# Altium project ESP32.PrjPcb
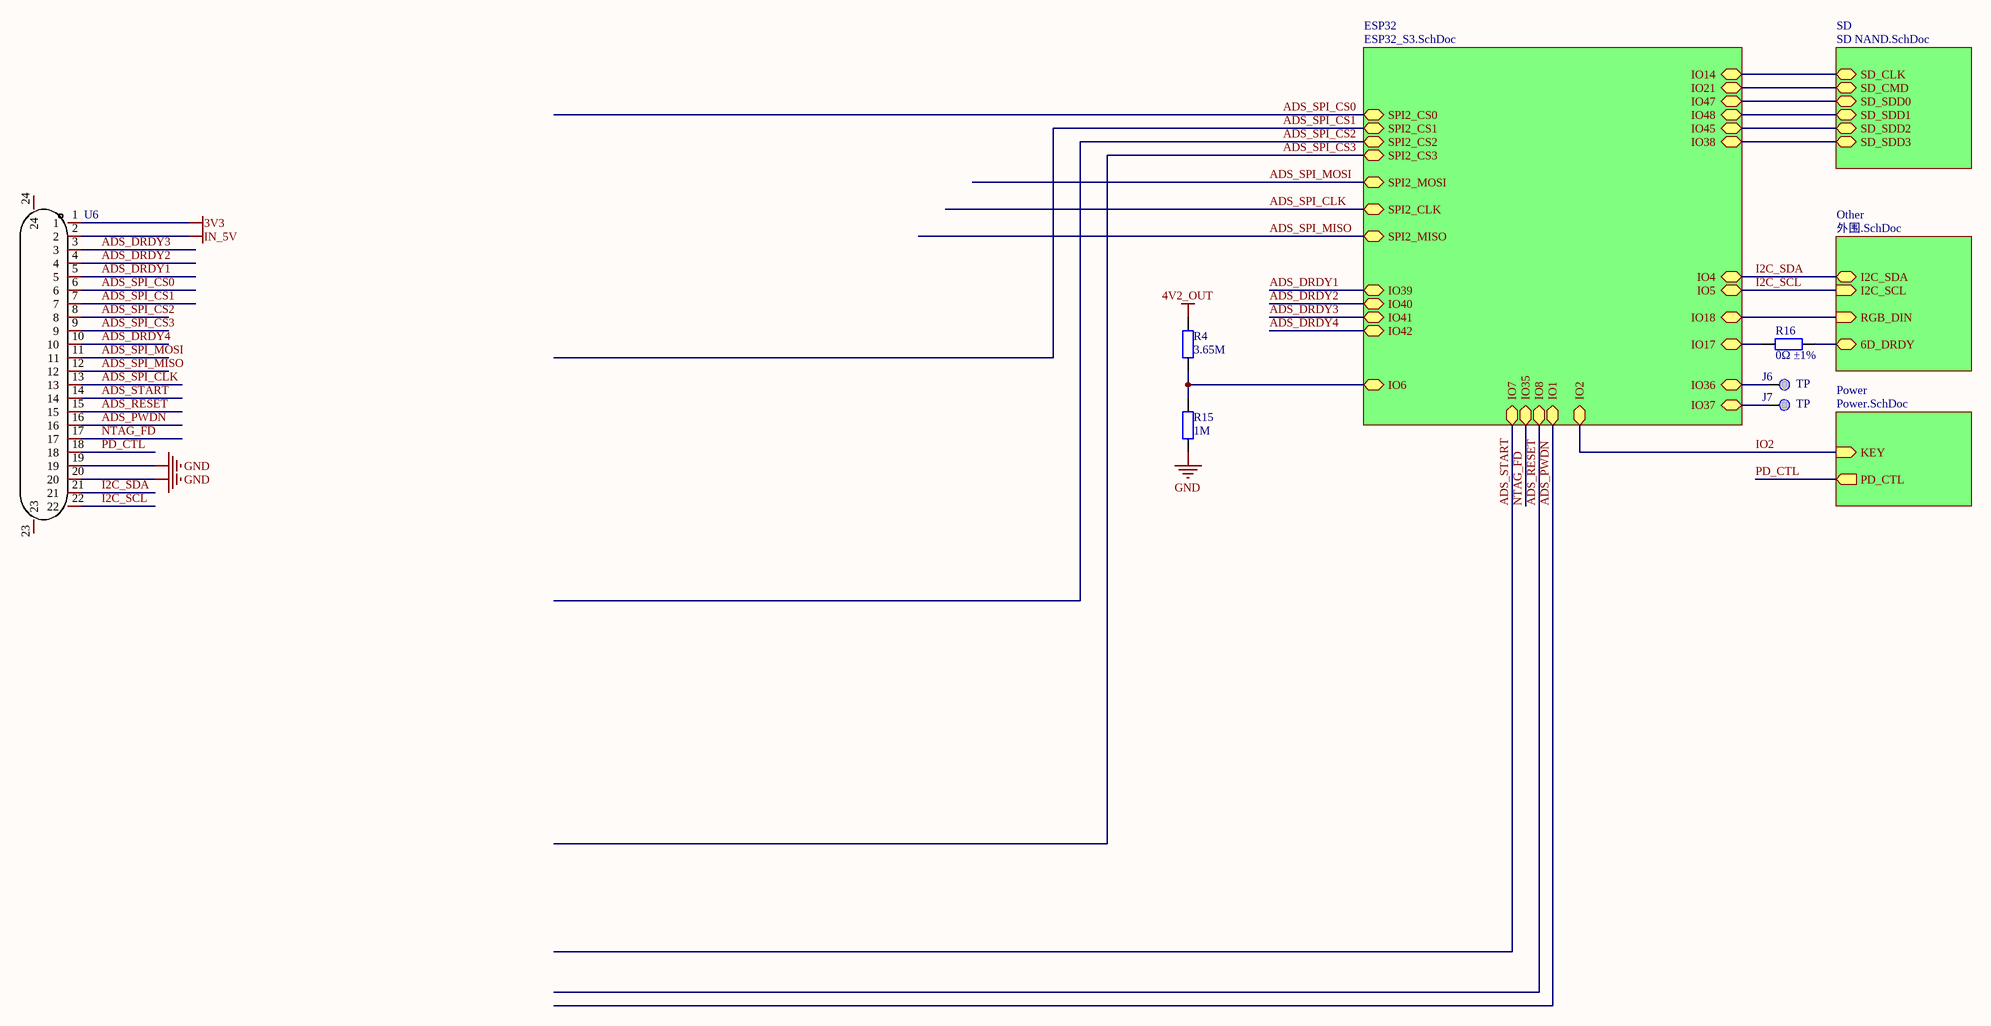
[diagram p0: Main.SchDoc]
5 sheets, 69 parts. Net scope: hierarchical (ports join the sheet entries above them; power ports are global).
Board file: ESP32.PcbDoc
Sheets:
  Main.SchDoc
    ESP32 = ESP32_S3.SchDoc
    SD = SD NAND.SchDoc
    Other = 外围.SchDoc
    Power = Power.SchDoc

## Sheet Main.SchDoc
size A2; SheetNumber: 1; SheetTotal: 5

### Parts
J6  TP  [TEST_Point]
J7  TP  [TEST_Point]
R4  3.65M  [0603_R]
R15  1M  [0603_R]
R16  0Ω ±1%  [0402_R]
U6  KH-FPC0.5-H1.0SMT-22P-QCHF  [FPC-SMD_22P-P0.50_XKB_X05A10L22G]  (value not drawn)

### Sub-sheets
ESP32 = ESP32_S3.SchDoc: SPI2_CLK (bidir), SPI2_MISO (bidir), SPI2_MOSI (bidir), SPI2_CS0 (bidir), SPI2_CS1 (bidir), SPI2_CS2 (bidir), SPI2_CS3 (bidir), IO4 (bidir), IO5 (bidir), IO6 (bidir), IO7 (bidir), IO17 (bidir), IO8 (bidir), IO1 (bidir), IO2 (bidir), IO14 (bidir), IO21 (bidir), IO47 (bidir), IO48 (bidir), IO45 (bidir), IO38 (bidir), IO39 (bidir), IO40 (bidir), IO41 (bidir), IO42 (bidir), IO18 (bidir), IO35 (bidir), IO36 (bidir), IO37 (bidir)
Other = 外围.SchDoc: I2C_SCL (in), I2C_SDA (bidir), RGB_DIN (in), 6D_DRDY (bidir)
Power = Power.SchDoc: KEY (in), PD_CTL (out)
SD = SD NAND.SchDoc: SD_CLK (bidir), SD_CMD (bidir), SD_SDD0 (bidir), SD_SDD1 (bidir), SD_SDD2 (bidir), SD_SDD3 (bidir)

### Nets
3V3: U6.1
4V2_OUT: R4.1
GND: R15.2 U6.19 U6.20
IN_5V: U6.2
6D_DRDY: R16.2 ; sheet Other/6D_DRDY
ADS_DRDY1: U6.5 ; sheet ESP32/IO39
ADS_DRDY2: U6.4 ; sheet ESP32/IO40
ADS_DRDY3: U6.3 ; sheet ESP32/IO41
ADS_DRDY4: U6.10 ; sheet ESP32/IO42
ADS_PWDN: U6.16 ; sheet ESP32/IO1
ADS_RESET: U6.15 ; sheet ESP32/IO8
ADS_SPI_CLK: U6.13 ; sheet ESP32/SPI2_CLK
ADS_SPI_CS0: U6.6 ; sheet ESP32/SPI2_CS0
ADS_SPI_CS1: U6.7 ; sheet ESP32/SPI2_CS1
ADS_SPI_CS2: U6.8 ; sheet ESP32/SPI2_CS2
ADS_SPI_CS3: U6.9 ; sheet ESP32/SPI2_CS3
ADS_SPI_MISO: U6.12 ; sheet ESP32/SPI2_MISO
ADS_SPI_MOSI: U6.11 ; sheet ESP32/SPI2_MOSI
ADS_START: U6.14 ; sheet ESP32/IO7
I2C_SCL: U6.22 ; sheet ESP32/IO5, sheet Other/I2C_SCL
I2C_SDA: U6.21 ; sheet ESP32/IO4, sheet Other/I2C_SDA
IO2: sheet ESP32/IO2, sheet Power/KEY
IO6: R4.2 R15.1 ; sheet ESP32/IO6
IO14: sheet ESP32/IO14, sheet SD/SD_CLK
IO17: R16.1 ; sheet ESP32/IO17
IO18: sheet ESP32/IO18, sheet Other/RGB_DIN
IO21: sheet ESP32/IO21, sheet SD/SD_CMD
IO36: J6.1 ; sheet ESP32/IO36
IO37: J7.1 ; sheet ESP32/IO37
IO38: sheet ESP32/IO38, sheet SD/SD_SDD3
IO45: sheet ESP32/IO45, sheet SD/SD_SDD2
IO47: sheet ESP32/IO47, sheet SD/SD_SDD0
IO48: sheet ESP32/IO48, sheet SD/SD_SDD1
NTAG_FD: U6.17 ; sheet ESP32/IO35  [project net IO35]
PD_CTL: U6.18 ; sheet Power/PD_CTL

Not connected (* = marked no-connect by the designer): U6 23 24

### Library data of the parts
J6 J7 = TestPad: Add into BOM: yes
R4 R15 R16 = Res2: Resistor; Add into BOM: yes; PackageReference: AXIAL-0.4; PackageDescription: Axial Device, Thru-Hole; 2 Leads; 0.4 in Pin Spacing
  R4: Value: 3.65M
  R15: Value: 1M
  R16: Value: 0Ω ±1%
U6 = KH-FPC0.5-H1.0SMT-22P-QCHF: 锁定特性:翻盖式;触点数量:22P;间距:0.5mm;; Manufacturer: kinghelm(金航标); Add into BOM: yes; Locking Feature: 翻盖式; Number of Contacts: 22P; Pitch: 0.5mm; Name: KH-FPC0.5-H1.0SMT-22P-QCHF; Symbol: KH-FPC0.5-H1.0SMT-22P-QCHF; Device: KH-FPC0.5-H1.0SMT-22P-QCHF; LCSC Part Name: KH-FPC0.5-H1.0SMT-22P-QCHF; Supplier Part: C3250120; Manufacturer Part: KH-FPC0.5-H1.0SMT-22P-QCHF; Supplier Footprint: SMD,P=0.5mm; JLCPCB Part Class: 扩展库; Datasheet: https://atta.szlcsc.com/upload/public/pdf/source/20220629/AF128159C3D91429B5983CCCE2A07C6D.pdf; Supplier: LCSC; Convert to PCB: yes; Height Above Board: 1mm

## Sheet ESP32_S3.SchDoc
size A3; SheetNumber: 5; SheetTotal: 5
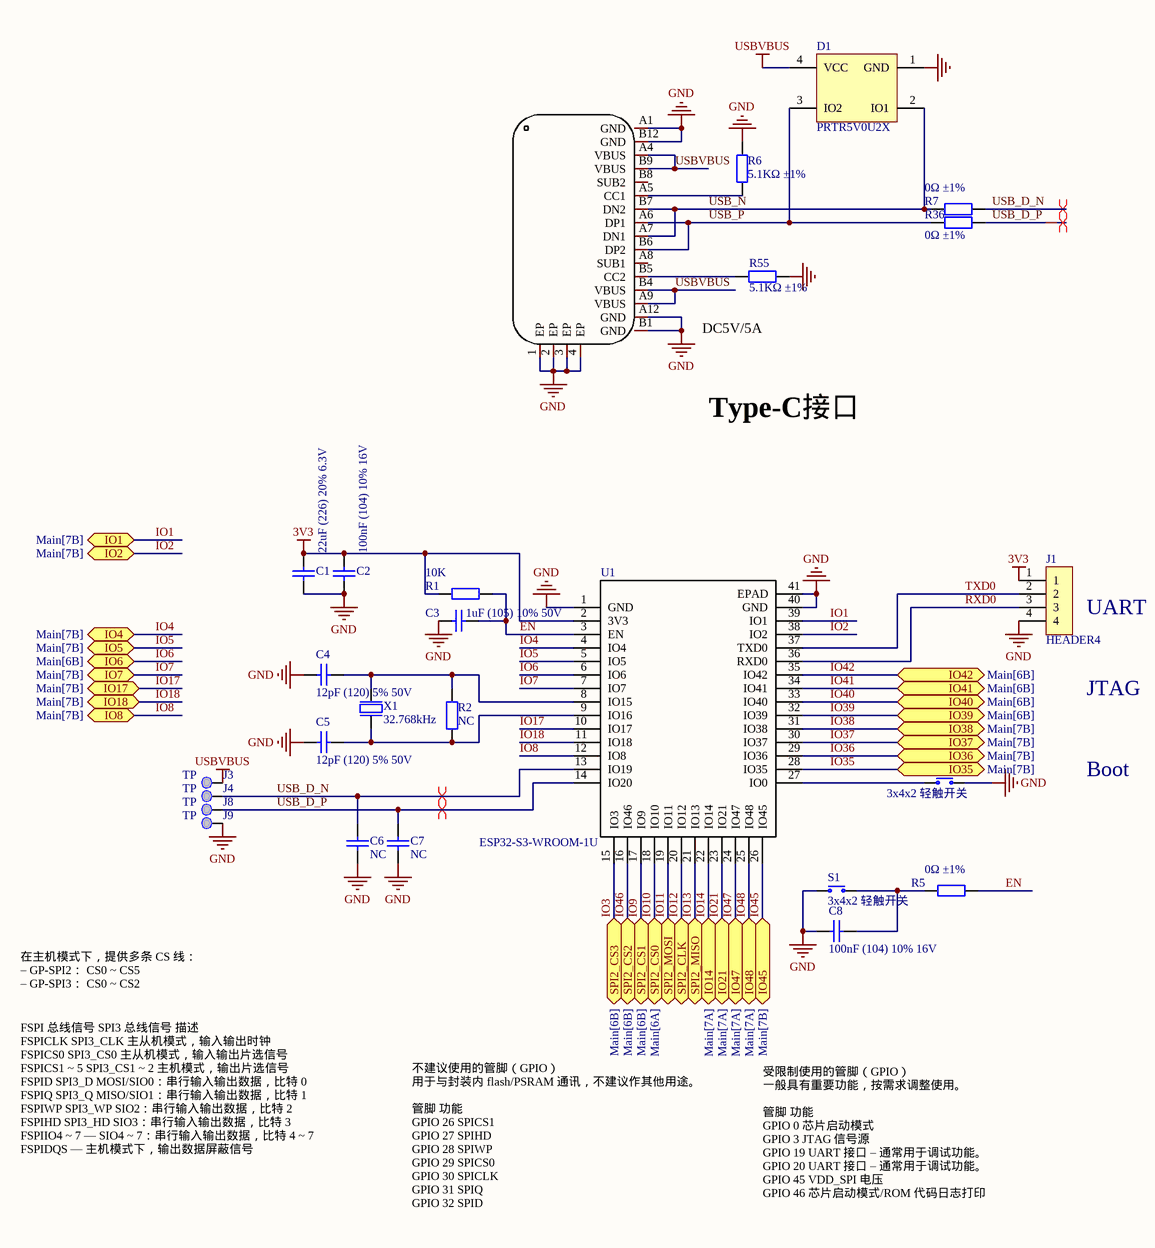
[diagram p1: ESP32_S3.SchDoc]

### Parts
C1  22uF (226) 20% 6.3V  [0402_C]
C2  100nF (104) 10% 16V  [0201_C]
C3  1uF (105) 10% 50V  [0201_C]
C4  12pF (120) 5% 50V  [0201_C]
C5  12pF (120) 5% 50V  [0201_C]
C6  NC  [0402_C]
C7  NC  [0402_C]
C8  100nF (104) 10% 16V  [0201_C]
D1  PRTR5V0U2X  [SOT190P230X110-4L]
J1  HEADER4  [HEADER4_2.54MM_排针]
J3  TP  [TEST_Point]
J4  TP  [TEST_Point]
J8  TP  [TEST_Point]
J9  TP  [TEST_Point]
R1  10K  [0201_R]
R2  NC  [0402_R]
R5  0Ω ±1%  [0402_R]
R6  5.1KΩ ±1%  [0402_R]
R7  0Ω ±1%  [0402_R]
R36  0Ω ±1%  [0402_R]
R55  5.1KΩ ±1%  [0402_R]
S1  3x4x2 轻触开关  [KEY_3x4X2包脚U型]
S3  3x4x2 轻触开关  [KEY_3x4X2包脚U型]
U1  ESP32-S3-WROOM-1U  [WIRELM-SMD_ESP32-S3-WROOM-1U]
USB1  KH-TYPE-C-16P  [USB-C-SMD_KH-TYPE-C-16P]  (value not drawn)
X1  32.768kHz  [XTAL_3215]

### Ports
IO1 (bidir, see Main[7B]), IO2 (bidir, see Main[7B]), IO4 (bidir, see Main[7B]), IO5 (bidir, see Main[7B]), IO6 (bidir, see Main[6B]), IO7 (bidir, see Main[7B]), IO8 (bidir, see Main[7B]), IO14 (bidir, see Main[7A]), IO17 (bidir, see Main[7B]), IO18 (bidir, see Main[7B]), IO21 (bidir, see Main[7A]), IO35 (bidir, see Main[7B]), IO36 (bidir, see Main[7B]), IO37 (bidir, see Main[7B]), IO38 (bidir, see Main[7B]), IO39 (bidir, see Main[6B]), IO40 (bidir, see Main[6B]), IO41 (bidir, see Main[6B]), IO42 (bidir, see Main[6B]), IO45 (bidir, see Main[7B]), IO47 (bidir, see Main[7A]), IO48 (bidir, see Main[7A]), SPI2_CLK (bidir, see Main[6B]), SPI2_CS0 (bidir, see Main[6A]), SPI2_CS1 (bidir, see Main[6B]), SPI2_CS2 (bidir, see Main[6B]), SPI2_CS3 (bidir, see Main[6B]), SPI2_MISO (bidir, see Main[6B]), SPI2_MOSI (bidir, see Main[6B])

### Nets
3V3: C1.2 C2.2 J1.1 R1.2 U1.2(3V3)
GND: C1.1 C2.1 C3.1 C4.1 C5.1 C6.1 C7.1 C8.2 D1.1(GND) J1.4 J9.1 R6.1 R55.2 S1.2 S3.1 U1.1(GND) U1.40(GND) U1.41(EPAD) USB1.1(EP) USB1.2(EP) USB1.3(EP) USB1.4(EP) USB1.A1(GND) USB1.A12(GND) USB1.B1(GND) USB1.B12(GND)
USBVBUS: D1.4(VCC) J3.1 USB1.A4(VBUS) USB1.A9(VBUS) USB1.B4(VBUS) USB1.B9(VBUS)
EN: C3.2 R1.1 R5.2 U1.3(EN)
IO1: U1.39(IO1) ; port IO1  [project net ADS_PWDN]
IO2: U1.38(IO2) ; port IO2
IO3: U1.15(IO3) ; port SPI2_CS3  [project net ADS_SPI_CS3]
IO4: U1.4(IO4) ; port IO4  [project net I2C_SDA]
IO5: U1.5(IO5) ; port IO5  [project net I2C_SCL]
IO6: U1.6(IO6) ; port IO6
IO7: U1.7(IO7) ; port IO7  [project net ADS_START]
IO8: U1.12(IO8) ; port IO8  [project net ADS_RESET]
IO9: U1.17(IO9) ; port SPI2_CS1  [project net ADS_SPI_CS1]
IO10: U1.18(IO10) ; port SPI2_CS0  [project net ADS_SPI_CS0]
IO11: U1.19(IO11) ; port SPI2_MOSI  [project net ADS_SPI_MOSI]
IO12: U1.20(IO12) ; port SPI2_CLK  [project net ADS_SPI_CLK]
IO13: U1.21(IO13) ; port SPI2_MISO  [project net ADS_SPI_MISO]
IO14: U1.22(IO14) ; port IO14
IO17: U1.10(IO17) ; port IO17
IO18: U1.11(IO18) ; port IO18
IO21: U1.23(IO21) ; port IO21
IO35: U1.28(IO35) ; port IO35
IO36: U1.29(IO36) ; port IO36
IO37: U1.30(IO37) ; port IO37
IO38: U1.31(IO38) ; port IO38
IO39: U1.32(IO39) ; port IO39  [project net ADS_DRDY1]
IO40: U1.33(IO40) ; port IO40  [project net ADS_DRDY2]
IO41: U1.34(IO41) ; port IO41  [project net ADS_DRDY3]
IO42: U1.35(IO42) ; port IO42  [project net ADS_DRDY4]
IO45: U1.26(IO45) ; port IO45
IO46: U1.16(IO46) ; port SPI2_CS2  [project net ADS_SPI_CS2]
IO47: U1.24(IO47) ; port IO47
IO48: U1.25(IO48) ; port IO48
RXD0: J1.3 U1.36(RXD0)
TXD0: J1.2 U1.37(TXD0)
USB_D_N: C6.2 J4.1 R7.2 U1.13(IO19)
USB_D_P: C7.2 J8.1 R36.2 U1.14(IO20)
USB_N: D1.2(IO1) R7.1 USB1.A7(DN1) USB1.B7(DN2)
USB_P: D1.3(IO2) R36.1 USB1.A6(DP1) USB1.B6(DP2)
NetC4_2: C4.2 R2.2 U1.8(IO15) X1.1(inp)
NetC5_2: C5.2 R2.1 U1.9(IO16) X1.2(out)
NetC8_1: C8.1 R5.1 S1.1
NetR6_2: R6.2 USB1.A5(CC1)
NetR55_1: R55.1 USB1.B5(CC2)
NetS3_2: S3.2 U1.27(IO0)

Not connected (* = marked no-connect by the designer): USB1 A8(SUB1) B8(SUB2)

### Layout directives
differential pair; differential pair class USB; net class USB: USB_D_N, USB_D_P

### Notes on the sheet
- DC5V/5A
- Type-C接口
- (near J1) UART
- JTAG
- Boot
- 在主机模式下，提供多条 CS 线：
  – GP­SPI2： CS0 ~ CS5
  – GP­SPI3： CS0 ~ CS2
- FSPI 总线信号 SPI3 总线信号 描述
  FSPICLK SPI3_CLK 主从机模式，输入输出时钟
  FSPICS0 SPI3_CS0 主从机模式，输入输出片选信号
  FSPICS1 ~ 5 SPI3_CS1 ~ 2 主机模式，输出片选信号
  FSPID SPI3_D MOSI/SIO0：串行输入输出数据，比特 0
  FSPIQ SPI3_Q MISO/SIO1：串行输入输出数据，比特 1
  FSPIWP SPI3_WP SIO2：串行输入输出数据，比特 2
  FSPIHD SPI3_HD SIO3：串行输入输出数据，比特 3
  FSPIIO4 ~ 7 — SIO4 ~ 7：串行输入输出数据，比特 4 ~ 7
  FSPIDQS — 主机模式下，输出数据屏蔽信号
- 不建议使用的管脚（GPIO）
  用于与封装内 flash/PSRAM 通讯，不建议作其他用途。
  管脚	功能
  GPIO 26	SPICS1
  GPIO 27	SPIHD
  GPIO 28	SPIWP
  GPIO 29	SPICS0
  GPIO 30	SPICLK
  GPIO 31	SPIQ
  GPIO 32	SPID
- 受限制使用的管脚（GPIO）
  一般具有重要功能，按需求调整使用。
  管脚	功能
  GPIO 0	芯片启动模式
  GPIO 3	JTAG 信号源
  GPIO 19	UART 接口 – 通常用于调试功能。
  GPIO 20	UART 接口 – 通常用于调试功能。
  GPIO 45	VDD_SPI 电压
  GPIO 46	芯片启动模式/ROM 代码日志打印

### Library data of the parts
C1 = 0603 22uF (226) 20% 6.3V: 贴片电容; ComponentLink1Description: 供应商链接; ComponentLink1URL: http://www.szlcsc.com/product/details_60514.html; Package: 0603; Supplier: LC; SuppliersPartNumber: C59461
C2 C8 = 0402 100nF (104) 10% 16V: 贴片电容; ComponentLink1Description: 供应商链接; ComponentLink1URL: http://www.szlcsc.com/product/details_1877.html; Package: 0402; Supplier: LC; SuppliersPartNumber: C1525
C3 = 0603 1uF (105) 10% 50V: 贴片电容; ComponentLink1Description: 供应商链接; ComponentLink1URL: http://www.szlcsc.com/product/details_16531.html; Package: 0603; Supplier: LC; SuppliersPartNumber: C15849
C4-C7 = 0402 12pF (120) 5% 50V: 贴片电容; ComponentLink1Description: 供应商链接; ComponentLink1URL: http://www.szlcsc.com/product/details_1899.html; Package: 0402; Supplier: LC; SuppliersPartNumber: C1547
D1 = PRTR5V0U2X: Ultra low capacitance double rail-to-rail ESD protection diode; Manufacturer: NXP; 2nd source part number: 152-4157; Artikkelnr Noca: 10069015; Artikkelnr Simpro: N.A.; Part Number: PRTR5V0U2X; Manufacturer Part Number: PRTR5V0U2X; Datasheet: http://www.farnell.com/datasheets/109718.pdf; LatestRevisionDate: 2012-06-11; Publisher: Nordic Semiconductor; Published: 2012-06-11; Value: PRTR5V0U2X; Note: *; Supplier: Digi-Key; Supplier part number: 568-4140-1-ND; 2nd source Supplier: Farnell; Footprint Doc: SOT-143B
J3 J4 J8 J9 = TestPad: Add into BOM: yes
R1 R2 = 0402 10KΩ (1002) 1%: 贴片电阻; ComponentLink1Description: 供应商链接; ComponentLink1URL: http://www.szlcsc.com/product/details_26487.html; Package: 0402; Supplier: LC; SuppliersPartNumber: C25744
R5 = 0402 0Ω (0R0) 1%: 贴片电阻; ComponentLink1Description: 供应商链接; ComponentLink1URL: http://www.szlcsc.com/product/details_17853.html; Package: 0402; Supplier: LC; SuppliersPartNumber: C17168
R6 R55 = 0402 5.1KΩ (5101) 1%: 贴片电阻; Add into BOM: yes; Supplier: LC; SuppliersPartNumber: C25905
R7 R36 = 0402 0Ω (0R0) 1%: 贴片电阻; Add into BOM: yes; Supplier: LC; SuppliersPartNumber: C17168
S1 S3 = SW-PB_包脚U型小乌龟: Add into BOM: yes; 供应商链接: https://item.szlcsc.com/6227348.html
USB1 = KH-TYPE-C-16P: Add into BOM: yes; Supplier: LCSC; 供应商链接: https://item.szlcsc.com/747093.html
X1 = XTAL_SMD3215_32.768kHz_9pF_General: XTAL SMD 3215, 32.768kHz, Cl=9pF, Total Tol: ±50ppm; Pad Count: 2; Part Number: XTAL_SMD3215_32.768kHz_9pF_General; LatestRevisionDate: 2016-08-19; Published: 2016-08-19; Value: 32.768kHz; Footprint Doc: XTAL_3215

## Sheet SD NAND.SchDoc
size A4; SheetNumber: 4; SheetTotal: 5
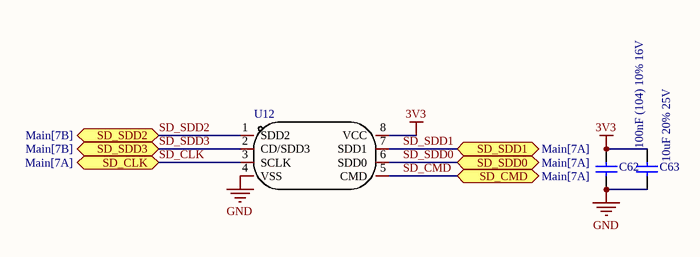
[diagram p2: SD NAND.SchDoc]

### Parts
C62  100nF (104) 10% 16V  [0402_C]
C63  10uF 20% 25V  [0402_C]
U12  CSNP1GCR01-BOW  [LGA-8_L6.0-W8.0-P1.27-TL]  (value not drawn)

### Ports
SD_CLK (bidir, see Main[7A]), SD_CMD (bidir, see Main[7A]), SD_SDD0 (bidir, see Main[7A]), SD_SDD1 (bidir, see Main[7A]), SD_SDD2 (bidir, see Main[7B]), SD_SDD3 (bidir, see Main[7B])

### Nets
3V3: C62.1 C63.2 U12.8(VCC)
GND: C62.2 C63.1 U12.4(VSS)
SD_CLK: U12.3(SCLK) ; port SD_CLK  [project net IO14]
SD_CMD: U12.5(CMD) ; port SD_CMD  [project net IO21]
SD_SDD0: U12.6(SDD0) ; port SD_SDD0  [project net IO47]
SD_SDD1: U12.7(SDD1) ; port SD_SDD1  [project net IO48]
SD_SDD2: U12.1(SDD2) ; port SD_SDD2  [project net IO45]
SD_SDD3: U12.2(CD/SDD3) ; port SD_SDD3  [project net IO38]

### Library data of the parts
C62 = 0402 100nF (104) 10% 16V: 贴片电容; ComponentLink1Description: 供应商链接; ComponentLink1URL: http://www.szlcsc.com/product/details_1877.html; Package: 0402; Supplier: LC; SuppliersPartNumber: C1525
C63 = 0603 10uF (106) 10% 10V: 贴片电容; ComponentLink1Description: 供应商链接; ComponentLink1URL: http://www.szlcsc.com/product/details_20411.html; Package: 0603; Supplier: LC; SuppliersPartNumber: C19702
U12 = CSNP1GCR01-BOW: 免驱动使用，标准SDIO接口，兼容SPI/SD/eMMC接口，兼容各大MCU平台;内置EDC/ECC，坏块管理，垃圾回收算法;可机贴，锁定晶圆和控制器,一致性高；内置SLC晶圆,10W次擦写寿命，通过1万次随机掉电测试，支持工业级温度-40°~+85°。 CS(创世) SD NAND也被很多开发者朋友称为：贴片式TF卡，贴片式SD卡，贴片卡，焊接式SD卡，焊接式TF卡，工业级TF卡，工业级SD卡，嵌入式SD卡等。主要解决了主控(比如STM32系列的MCU单片机 )使用 SLC NAND FLASH,SPI; Manufacturer: CS(创世); Add into BOM: yes; Name: CSNP1GCR01-BOW; Symbol: CSNP1GCR01-BOW; Device: CSNP1GCR01-BOW; LCSC Part Name: 1Gb SD NAND 一代 SD NAND 一代; Supplier Part: C2691593; Manufacturer Part: CSNP1GCR01-BOW; Supplier Footprint: LGA-8(6x8); JLCPCB Part Class: 扩展库; Datasheet: https://atta.szlcsc.com/upload/public/pdf/source/20210222/C2691593_195F15B6690BC3EBF1684FE727FBFF20.pdf; Supplier: LCSC; Convert to PCB: yes

## Sheet 外围.SchDoc
size A4; SheetNumber: 2; SheetTotal: 5
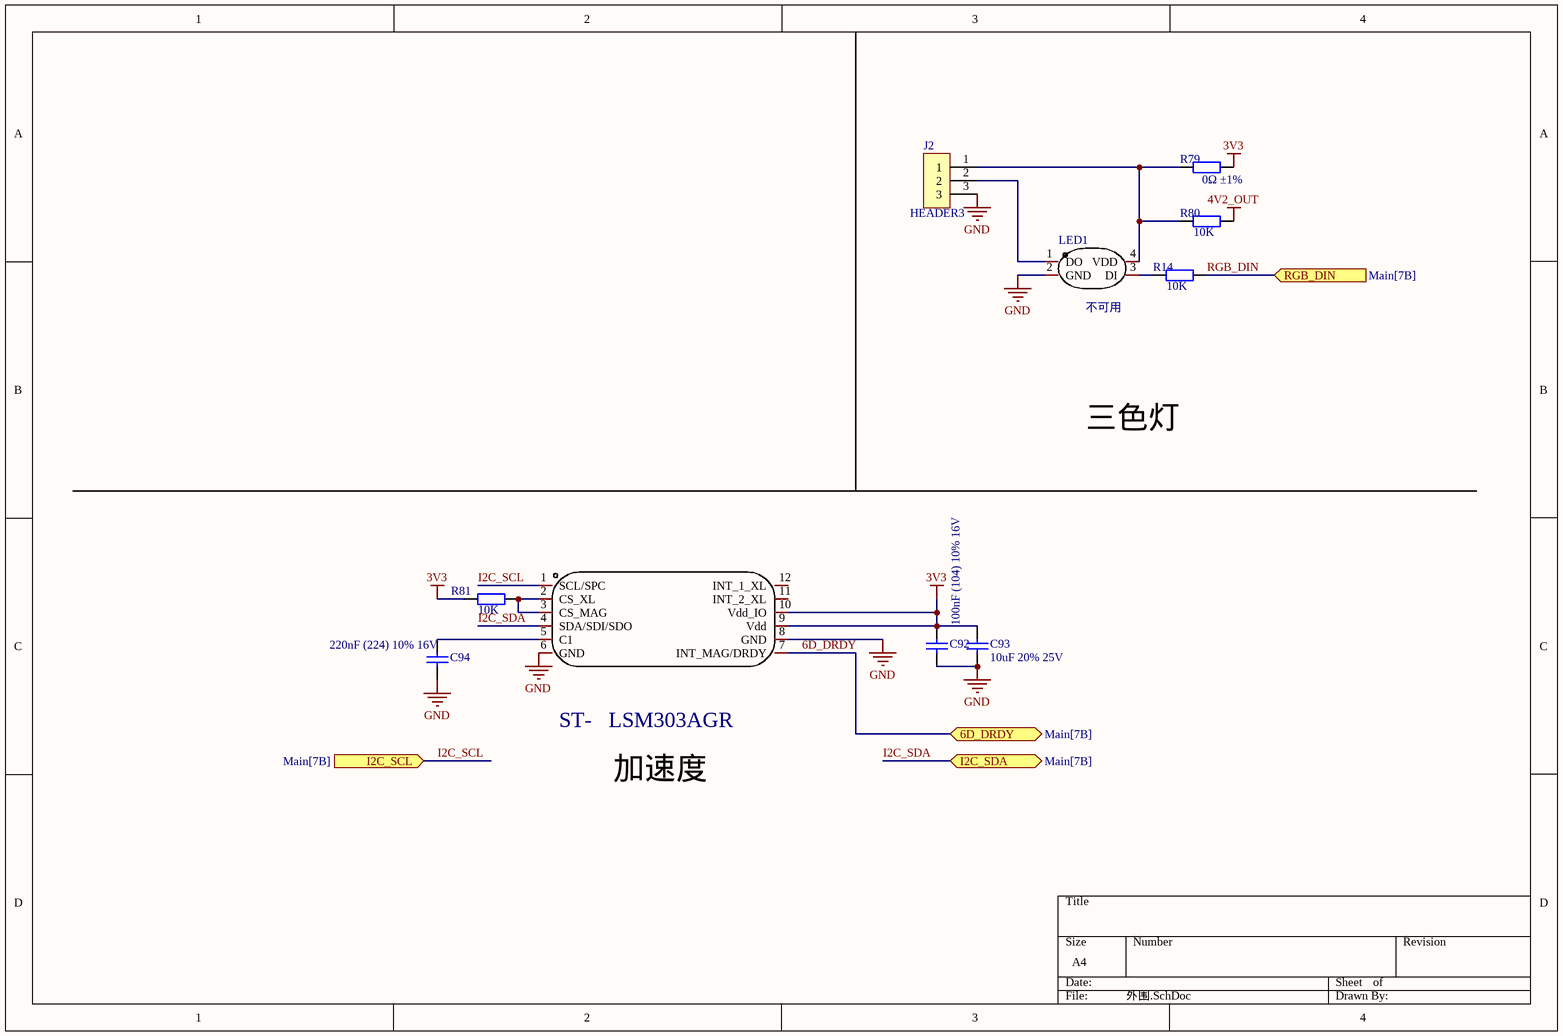
[diagram p3: 外围.SchDoc]

### Parts
C92  100nF (104) 10% 16V  [0402_C]
C93  10uF 20% 25V  [0402_C]
C94  220nF (224) 10% 16V  [0201_C]
J2  HEADER3  [HEADER3]
LED1  WS2812B-2020  [LED-SMD_4P-L2.0-W2.0-TL_WS2812B-2020]  (value not drawn)
R14  10K  [0402_R]
R79  0Ω ±1%  [0402_R]
R80  value 10K  [0402_R]  (hidden comment: NC)
R81  10K  [0201_R]
U15  LSM303AGRTR  [LGA-12_L2.0-W2.0-P0.50-BL]  (value not drawn)

### Ports
6D_DRDY (bidir, see Main[7B]), I2C_SCL (in, see Main[7B]), I2C_SDA (bidir, see Main[7B]), RGB_DIN (in, see Main[7B])

### Nets
3V3: C92.2 C93.2 R79.2 R81.1 U15.9(Vdd) U15.10(Vdd_IO)
4V2_OUT: R80.2
GND: C92.1 C93.1 C94.1 J2.3 LED1.2(GND) U15.6(GND) U15.8(GND)
6D_DRDY: U15.7(INT_MAG/DRDY) ; port 6D_DRDY
I2C_SCL: U15.1(SCL/SPC) ; port I2C_SCL
I2C_SDA: U15.4(SDA/SDI/SDO) ; port I2C_SDA
RGB_DIN: R14.2 ; port RGB_DIN  [project net IO18]
NetC94_2: C94.2 U15.5(C1)
NetJ2_1: J2.1 LED1.4(VDD) R79.1 R80.1
NetJ2_2: J2.2 LED1.1(DO)
NetLED1_3: LED1.3(DI) R14.1
NetR81_2: R81.2 U15.2(CS_XL) U15.3(CS_MAG)

Not connected (* = marked no-connect by the designer): U15 11(INT_2_XL) 12(INT_1_XL)

### Notes on the sheet
- (near LED1) 不可用
- 三色灯
- ST-   LSM303AGR
- 加速度

### Library data of the parts
C92 = 0402 100nF (104) 10% 16V: 贴片电容; ComponentLink1Description: 供应商链接; ComponentLink1URL: http://www.szlcsc.com/product/details_1877.html; Package: 0402; Supplier: LC; SuppliersPartNumber: C1525
C93 = 0402 10uF (106) 20% 6.3V: 贴片电容; ComponentLink1Description: 供应商链接; ComponentLink1URL: http://www.szlcsc.com/product/details_16204.html; Package: 0402; Supplier: LC; SuppliersPartNumber: C15525
C94 = 0402 220nF (224) 10% 16V: 贴片电容; ComponentLink1Description: 供应商链接; ComponentLink1URL: http://www.szlcsc.com/product/details_17456.html; Package: 0402; Supplier: LC; SuppliersPartNumber: C16772
LED1 = WS2812B-2020: 发光颜色:RGB三色;二极管配置:-;功率:-;透镜颜色:-;主波长:470.4nm；622.5nm；515.6nm;色温:-;发光角度:-;安装方式:-;工作温度:-;; Manufacturer: worldsemi; Add into BOM: yes; Emitted Color: RGB三色; Forward Current: 12mA; Name: WS2812B-2020; Symbol: WS2812B-2020; Device: WS2812B-2020; LCSC Part Name: RGB三色 （注意防潮，请查阅规格书中对应具体内容）; Supplier Part: C965555; Manufacturer Part: WS2812B-2020; Supplier Footprint: SMD,2x2mm; JLCPCB Part Class: 扩展库; Datasheet: https://atta.szlcsc.com/upload/public/pdf/source/20201203/C965555_5C919C4B6231E6ADE06011FB0D94282B.pdf; Supplier: LCSC; Convert to PCB: yes; Diode Configuration: -; Power Dissipation: -; Lens Color: -; Dominant Wavelength: 470.4nm；622.5nm；515.6nm; Peak Wavelength: -; Color Temperature: -; Viewing Angle: -; Mounting Sytle: -; Operating Temperature: -
R14 R79-R81 = Res2: Resistor
  R14 R81: Value: 10K
U15 = LSM303AGRTR: Manufacturer: ST(意法半导体); Add into BOM: yes; Name: LSM303AGRTR; Symbol: LSM303AGRTR; Device: LSM303AGRTR; LCSC Part Name: LSM303AGRTR; Supplier Part: C126671; Manufacturer Part: LSM303AGRTR; Supplier Footprint: LGA-12; JLCPCB Part Class: Extended Part; Datasheet: https://atta.szlcsc.com/upload/public/pdf/source/20180403/C126671_E4CABC5ABBEC58D74E548CEDEFA0489C.pdf; Supplier: LCSC; Convert to PCB: yes

## Sheet Power.SchDoc
size A2; SheetNumber: 3; SheetTotal: 5
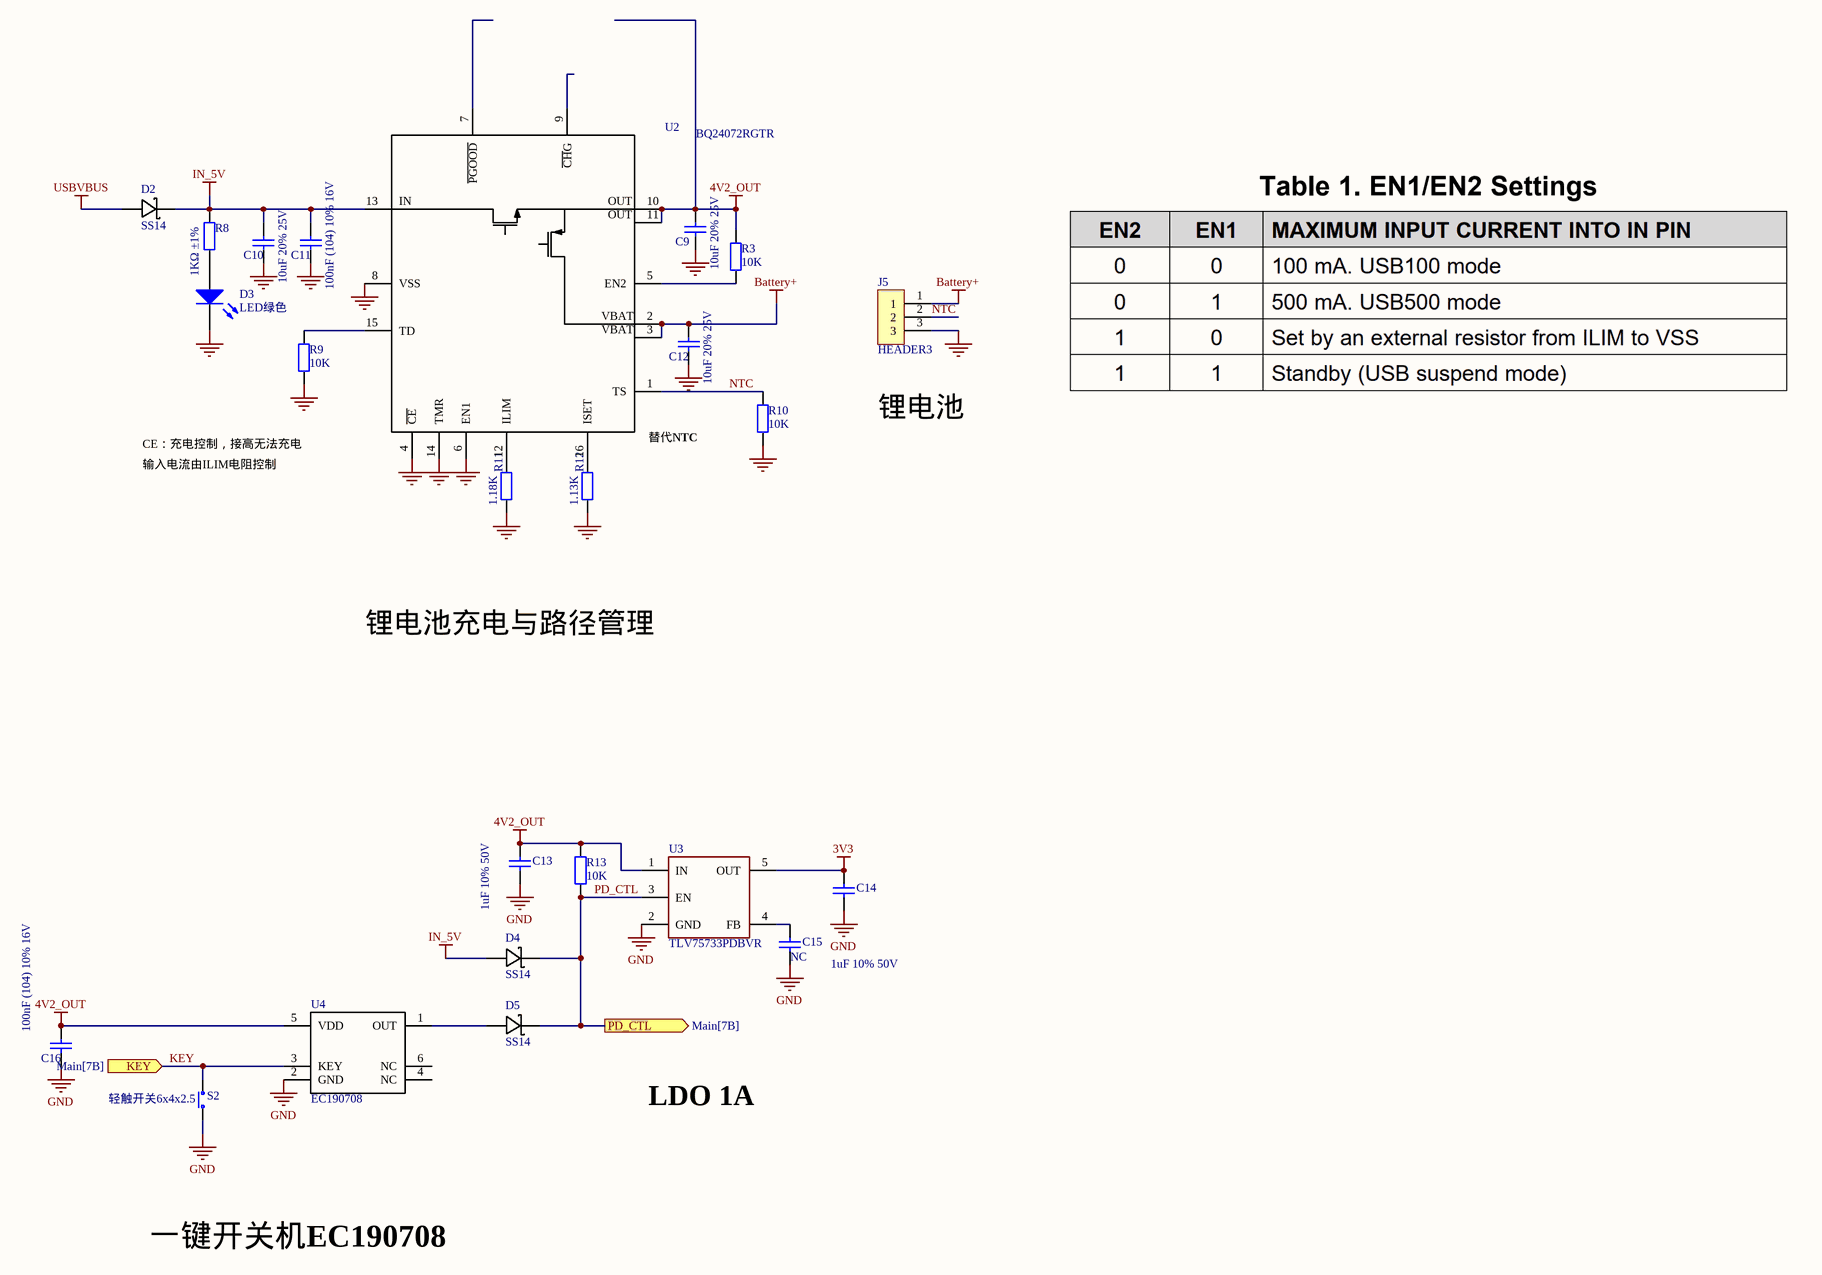
[diagram p4: Power.SchDoc]

### Parts
C9  10uF 20% 25V  [0603_C]
C10  10uF 20% 25V  [0402_C]
C11  100nF (104) 10% 16V  [0402_C]
C12  10uF 20% 25V  [0603_C]
C13  1uF 10% 50V  [0402_C]
C14  1uF 10% 50V  [0402_C]
C15  NC  [0402_C]
C16  100nF (104) 10% 16V  [0402_C]
D2  SS14  [DO-214AC]
D3  LED绿色  [LED_0402]
D4  SS14  [DO-214AC]
D5  SS14  [DO-214AC]
J5  HEADER3  [HEADER3]
R3  10K  [0402_R]
R8  1KΩ ±1%  [0402_R]
R9  10K  [0402_R]
R10  10K  [0402_R]
R11  1.18K  [0402_R]
R12  1.13K  [0402_R]
R13  10K  [0402_R]
S2  轻触开关6x4x2.5  [SW-SMD_L6.0-W4.0-LS7.2]
U2  BQ24072RGTR  [QFN-16_L3.0-W3.0-P0.50-TL-EP]
U3  TLV75733PDBVR  [SOT-23_5]
U4  EC190708  [SOT-23-6]

### Ports
KEY (in, see Main[7B]), PD_CTL (out, see Main[7B])

### Nets
3V3: C14.2 U3.5(OUT)
4V2_OUT: C9.2 C13.2 C16.2 R3.1 R13.2 U2.10(OUT) U2.11(OUT) U3.1(IN) U4.5(VDD)
Battery+: C12.2 J5.1 U2.2(BAT) U2.3(BAT)
GND: C9.1 C10.1 C11.1 C12.1 C13.1 C14.1 C15.1 C16.1 D3.K J5.3 R9.2 R10.2 R11.2 R12.2 S2.2 U2.4(~{CE}) U2.6(EN1) U2.8(VSS) U2.14(TMR) U3.2(GND) U4.2(GND)
IN_5V: C10.2 C11.2 D2.2(A) D4.1(K) R8.2 U2.13(IN)
USBVBUS: D2.1(K)
KEY: S2.1 U4.3(KEY) ; port KEY  [project net IO2]
NTC: J5.2 R10.1 U2.1(TS)
PD_CTL: D4.2(A) D5.2(A) R13.1 U3.3(EN) ; port PD_CTL
NetC15_2: C15.2 U3.4(FB)
NetD3_A: D3.A R8.1
NetD5_1: D5.1(K) U4.1(OUT)
NetR3_2: R3.2 U2.5(EN2)
NetR9_1: R9.1 U2.15(TD)
NetR11_1: R11.1 U2.12(ILIM)
NetR12_1: R12.1 U2.16(ISET)

Not connected (* = marked no-connect by the designer): U2 7(~{PGOOD}) 9(~{CH}G); U4 4(NC) 6(NC)

### Notes on the sheet
- CE：充电控制，接高无法充电
- 输入电流由ILIM电阻控制
- (near U2) 替代NTC
- 锂电池
- 锂电池充电与路径管理
- LDO 1A
- 一键开关机EC190708
- (in symbol BQ24072) VBAT

### Library data of the parts
C9 C10 C12 = 0402 10uF (106) 20% 6.3V: 贴片电容; Add into BOM: yes; Supplier: LC; SuppliersPartNumber: C15525
C11 C15 C16 = 0603 100nF (104) 10% 50V: 贴片电容; Add into BOM: yes; Supplier: LC; SuppliersPartNumber: C14663
  C15: 供应商链接: http://www.szlcsc.com/product/details_15331.html
C13 C14 = 0603 1uF (105) 10% 50V: 贴片电容; Add into BOM: yes; Supplier: LC; SuppliersPartNumber: C15849
D2 D4 D5 = SS14: 1A，40V
D3 = LED0: Typical INFRARED GaAs LED; Add into BOM: yes; 供应商链接: https://item.szlcsc.com/75457.html
R3 R8-R13 = Res2: Resistor; Add into BOM: yes; PackageReference: AXIAL-0.4; PackageDescription: Axial Device, Thru-Hole; 2 Leads; 0.4 in Pin Spacing
  R3 R9 R10 R13: Value: 10K
  R8: Value: 1KΩ ±1%
  R11: Value: 1.18K
  R12: Value: 1.13K
S2 = SW-PB_包脚U型小乌龟: Add into BOM: yes; 供应商链接: https://item.szlcsc.com/6227348.html
U2 = BQ24072: TI; Add into BOM: yes; 供应商链接: https://item.szlcsc.com/151614.html
U3 = TLV75733

## Nets that join several sheets
3V3: Main (U6.1), ESP32_S3 (5 pins), SD NAND (C62.1 C63.2 U12.8), 外围 (6 pins), Power (C14.2 U3.5)
4V2_OUT: Main (R4.1), 外围 (R80.2), Power (9 pins)
GND: Main (R15.2 U6.19 U6.20), ESP32_S3 (26 pins), SD NAND (C62.2 C63.1 U12.4), 外围 (7 pins), Power (21 pins)
IN_5V: Main (U6.2), Power (6 pins)
USBVBUS: ESP32_S3 (6 pins), Power (D2.1)
6D_DRDY: Main (R16.2), 外围 (U15.7)
ADS_DRDY1: Main (U6.5), ESP32_S3 (U1.32)
ADS_DRDY2: Main (U6.4), ESP32_S3 (U1.33)
ADS_DRDY3: Main (U6.3), ESP32_S3 (U1.34)
ADS_DRDY4: Main (U6.10), ESP32_S3 (U1.35)
ADS_PWDN: Main (U6.16), ESP32_S3 (U1.39)
ADS_RESET: Main (U6.15), ESP32_S3 (U1.12)
ADS_SPI_CLK: Main (U6.13), ESP32_S3 (U1.20)
ADS_SPI_CS0: Main (U6.6), ESP32_S3 (U1.18)
ADS_SPI_CS1: Main (U6.7), ESP32_S3 (U1.17)
ADS_SPI_CS2: Main (U6.8), ESP32_S3 (U1.16)
ADS_SPI_CS3: Main (U6.9), ESP32_S3 (U1.15)
ADS_SPI_MISO: Main (U6.12), ESP32_S3 (U1.21)
ADS_SPI_MOSI: Main (U6.11), ESP32_S3 (U1.19)
ADS_START: Main (U6.14), ESP32_S3 (U1.7)
I2C_SCL: Main (U6.22), ESP32_S3 (U1.5), 外围 (U15.1)
I2C_SDA: Main (U6.21), ESP32_S3 (U1.4), 外围 (U15.4)
IO2: ESP32_S3 (U1.38), Power (S2.1 U4.3)
IO6: Main (R4.2 R15.1), ESP32_S3 (U1.6)
IO14: ESP32_S3 (U1.22), SD NAND (U12.3)
IO17: Main (R16.1), ESP32_S3 (U1.10)
IO18: ESP32_S3 (U1.11), 外围 (R14.2)
IO21: ESP32_S3 (U1.23), SD NAND (U12.5)
IO35: Main (U6.17), ESP32_S3 (U1.28)
IO36: Main (J6.1), ESP32_S3 (U1.29)
IO37: Main (J7.1), ESP32_S3 (U1.30)
IO38: ESP32_S3 (U1.31), SD NAND (U12.2)
IO45: ESP32_S3 (U1.26), SD NAND (U12.1)
IO47: ESP32_S3 (U1.24), SD NAND (U12.6)
IO48: ESP32_S3 (U1.25), SD NAND (U12.7)
PD_CTL: Main (U6.18), Power (D4.2 D5.2 R13.1 U3.3)